# Altium schematic sheet Sweep Oscillator.SchDoc
size Tabloid
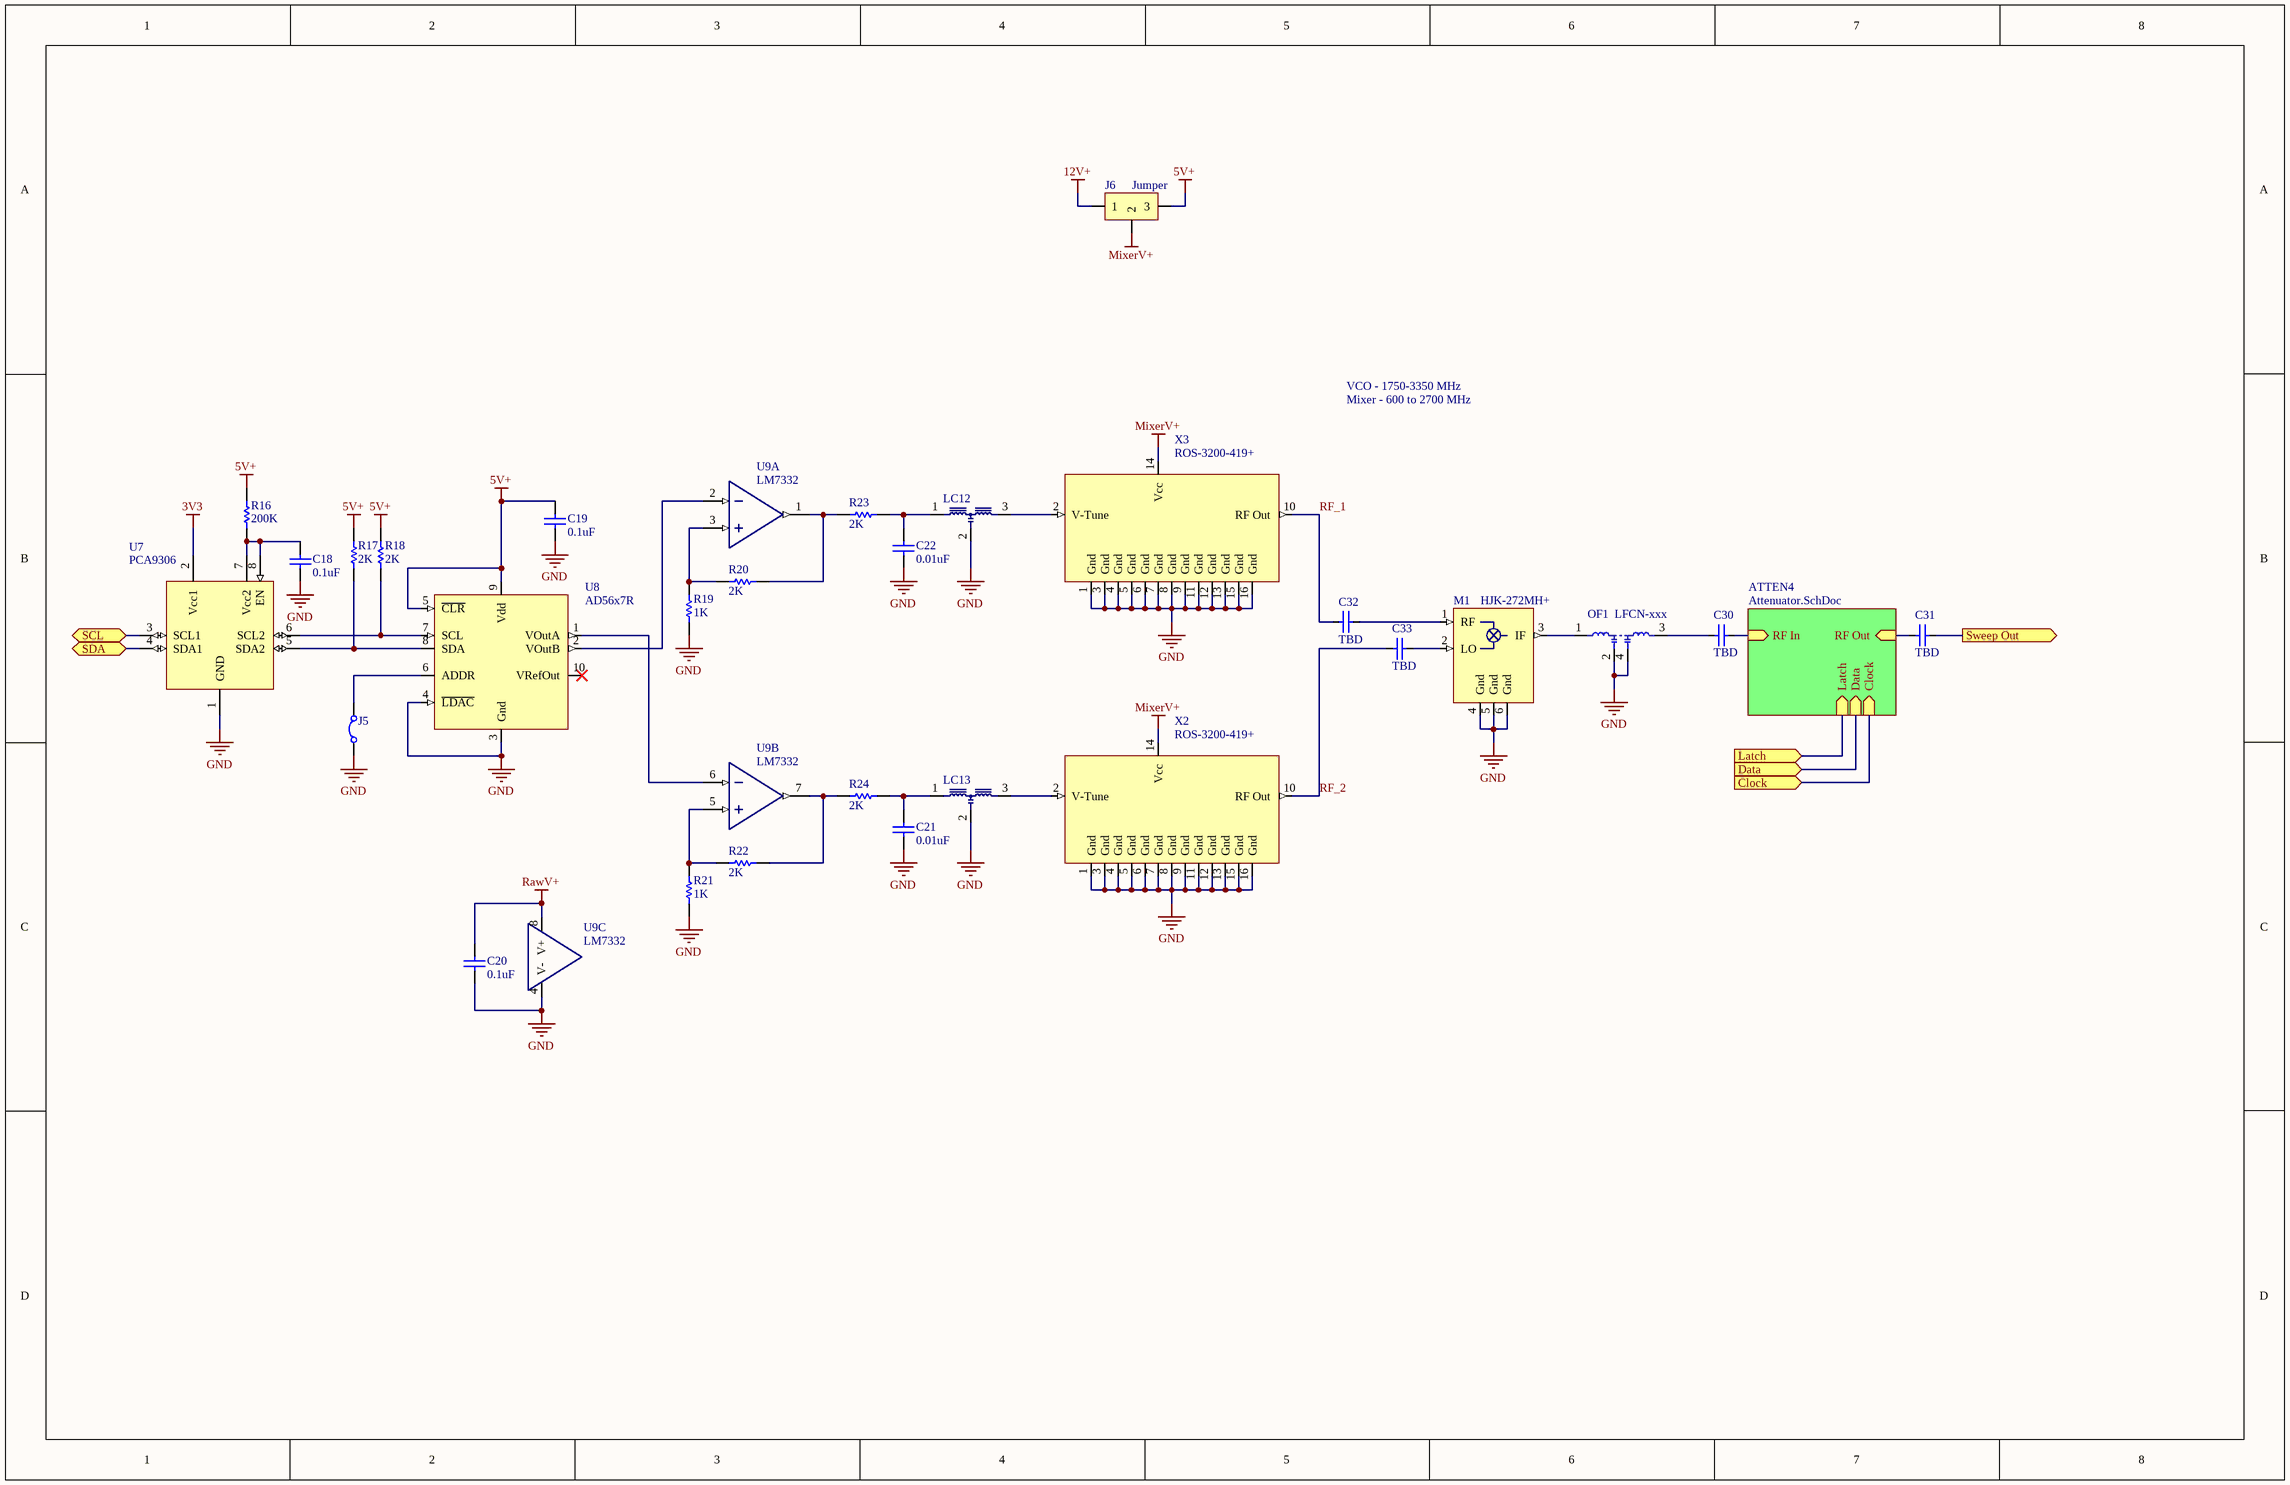
[diagram p0: Sweep Oscillator.SchDoc]

## Parts
C18  value 0.1uF  [0603C]  (hidden comment: Cap Semi)
C19  value 0.1uF  [0603C]  (hidden comment: Cap Semi)
C20  value 0.1uF  [0603C]  (hidden comment: Cap Semi)
C21  value 0.01uF  [0603C]  (hidden comment: Cap Semi)
C22  value 0.01uF  [0603C]  (hidden comment: Cap Semi)
C30  value TBD  [0402C]  (hidden comment: Cap)
C31  value TBD  [0402C]  (hidden comment: Cap)
C32  value TBD  [0402C]  (hidden comment: Cap)
C33  value TBD  [0402C]  (hidden comment: Cap)
J5  (no value)  [0603R]
J6  Jumper  [HDR1X3]
LC12  MEM2012F  [MEM2012S LC Filter]  (value not drawn)
LC13  MEM2012F  [MEM2012S LC Filter]  (value not drawn)
M1  HJK-272MH+  [TTT881]
OF1  LFCN-xxx  [FV1206]
R16  value 200K  [0603R]  (hidden comment: Res Semi)
R17  value 2K  [0603R]  (hidden comment: Res Semi)
R18  value 2K  [0603R]  (hidden comment: Res Semi)
R19  value 1K  [0603R]  (hidden comment: Res Semi)
R20  value 2K  [0603R]  (hidden comment: Res Semi)
R21  value 1K  [0603R]  (hidden comment: Res Semi)
R22  value 2K  [0603R]  (hidden comment: Res Semi)
R23  value 2K  [0603R]  (hidden comment: Res Semi)
R24  value 2K  [0603R]  (hidden comment: Res Semi)
U7  PCA9306  [TSOP65P490-8AN]
U8  AD56x7R  [TSSOP50P490-10AN]
U9  LM7332  [SOIC127P600-8CN]  (parts A,B,C of 3)
X2  ROS-3200-419+  [CK605]
X3  ROS-3200-419+  [CK605]

## Sub-sheets
ATTEN4 = Attenuator.SchDoc: RF In (in), RF Out (in), Clock (in), Data (in), Latch (in)

## Ports
Clock (in), Data (in), Latch (in), SCL (bidir), SDA (bidir), Sweep Out (out)

## Nets
3V3: U7.2(Vcc1)
5V+: C19.2 J6.3 R16.2 R17.2 R18.2 U8.5(~{CLR}) U8.9(Vdd)
12V+: J6.1
GND: C18.1 C19.1 C20.1 C21.1 C22.1 J5.1(C1) LC12.2 LC13.2 M1.4(Gnd) M1.5(Gnd) M1.6(Gnd) OF1.2 OF1.4 R19.2 R21.1 U7.1(GND) U8.3(Gnd) U8.4(~{LDAC}) U9.4(V-) X2.1(Gnd) X2.3(Gnd) X2.4(Gnd) X2.5(Gnd) X2.6(Gnd) X2.7(Gnd) X2.8(Gnd) X2.9(Gnd) X2.11(Gnd) X2.12(Gnd) X2.13(Gnd) X2.15(Gnd) X2.16(Gnd) X3.1(Gnd) X3.3(Gnd) X3.4(Gnd) X3.5(Gnd) X3.6(Gnd) X3.7(Gnd) X3.8(Gnd) X3.9(Gnd) X3.11(Gnd) X3.12(Gnd) X3.13(Gnd) X3.15(Gnd) X3.16(Gnd)
MixerV+: J6.2 X2.14(Vcc) X3.14(Vcc)
RawV+: C20.2 U9.8(V+)
Clock: port Clock, sheet ATTEN4/Clock
Data: port Data, sheet ATTEN4/Data
Latch: port Latch, sheet ATTEN4/Latch
RF_1: C32.1 X3.10(RF_Out)
RF_2: C33.1 X2.10(RF_Out)
SCL: U7.3(SCL1) ; port SCL
SDA: U7.4(SDA1) ; port SDA
Sweep Out: C31.2 ; port Sweep Out
NetC18_2: C18.2 R16.1 U7.7(Vcc2) U7.8(EN)
NetC21_2: C21.2 LC13.1 R24.1
NetC22_2: C22.2 LC12.1 R23.1
NetC30_1: C30.1 OF1.3
NetC30_2: C30.2 ; sheet ATTEN4/RF In
NetC31_1: C31.1 ; sheet ATTEN4/RF Out
NetC32_2: C32.2 M1.1(RF)
NetC33_2: C33.2 M1.2(LO)
NetJ5_2: J5.2(C2) U8.6(ADDR)
NetLC12_3: LC12.3 X3.2(V-Tune)
NetLC13_3: LC13.3 X2.2(V-Tune)
NetM1_3: M1.3(IF) OF1.1
NetR17_1: R17.1 U7.5(SDA2) U8.8(SDA)
NetR18_1: R18.1 U7.6(SCL2) U8.7(SCL)
NetR19_1: R19.1 R20.1 U9.3(In_A_+)
NetR20_2: R20.2 R23.2 U9.1(Out_A)
NetR21_2: R21.2 R22.2 U9.5(In_B_+)
NetR22_1: R22.1 R24.2 U9.7(Out_B)
NetU8_1: U8.1(VOutA) U9.6(In_B_-)
NetU8_2: U8.2(VOutB) U9.2(In_A_-)

Not connected (* = marked no-connect by the designer): U8 10(VRefOut)*

## Notes on the sheet
- VCO - 1750-3350 MHz
- Mixer - 600 to 2700 MHz

## Library data of the parts
C18-C22 = Cap Semi: Capacitor (Semiconductor SIM Model); Published: 8-Jun-2000; LatestRevisionDate: 17-Jul-2002; LatestRevisionNote: Re-released for DXP Platform.; PackageReference: C1206; Publisher: Altium Limited
C30-C33 = Cap: Capacitor; Published: 8-Jun-2000; LatestRevisionDate: 17-Jul-2002; LatestRevisionNote: Re-released for DXP Platform.; PackageReference: RAD-0.3; Publisher: Altium Limited
J5 = Jumper - SMT Resistor
J6 = Jumper - 3 Pin: Jumper - 3-Pin; LatestRevisionDate: 17-Jul-2002; LatestRevisionNote: Re-released for DXP Platform.; Publisher: Altium Limited
LC12 LC13 = MEM2012F - Signal Filter: Signal Line 3-terminal Filters
M1 = HJK-272MH+: Wideband Frequency Mixer Level 13 (LO Power +13 dBm) 600 to 2700 MHz
OF1 = LFCN-xxx Filter: Ceramic Low Pass Filter
R16-R24 = Res Semi: Semiconductor Resistor; Published: 8-Jun-2000; LatestRevisionDate: 17-Jul-2002; LatestRevisionNote: Re-released for DXP Platform.; PackageReference: AXIAL-0.5; Publisher: Altium Limited
U7 = PCA9306: Dual bidirectional I2C-bus and SMBus voltage-level translator
U8 = AD56x7R: Dual, 12-/14-/16-Bit nanoDACs® with  5 ppm/°C On-Chip Reference, I2C Interface
U9 = LM7332: Dual Rail-to-Rail Input/Output, 30V, Wide Voltage Range, High Output Operational Amplifier; Datasheet: http://www.analog.com/static/imported-files/data_sheets/AD822.pdf
X2 X3 = ROS-2650 VCO: Linear Tuning 2165 to 2650 MHz SMT Voltage Controlled Oscillator